# EasyEDA Pro project MAX2831_2024_REUSE.eprj

# Schematic MAX2831_2024_REUSE
Board Name: MAX2831_2024_REUSE; Create Date: 2024-12-31; Page Name: P1; Project Name: MAX2831_2024_REUSE; Schematic Name: MAX2831_2024_REUSE; Update Date: 2025-01-03; Company: EasyEDA.com; Page Size: A4; Version: V1.0
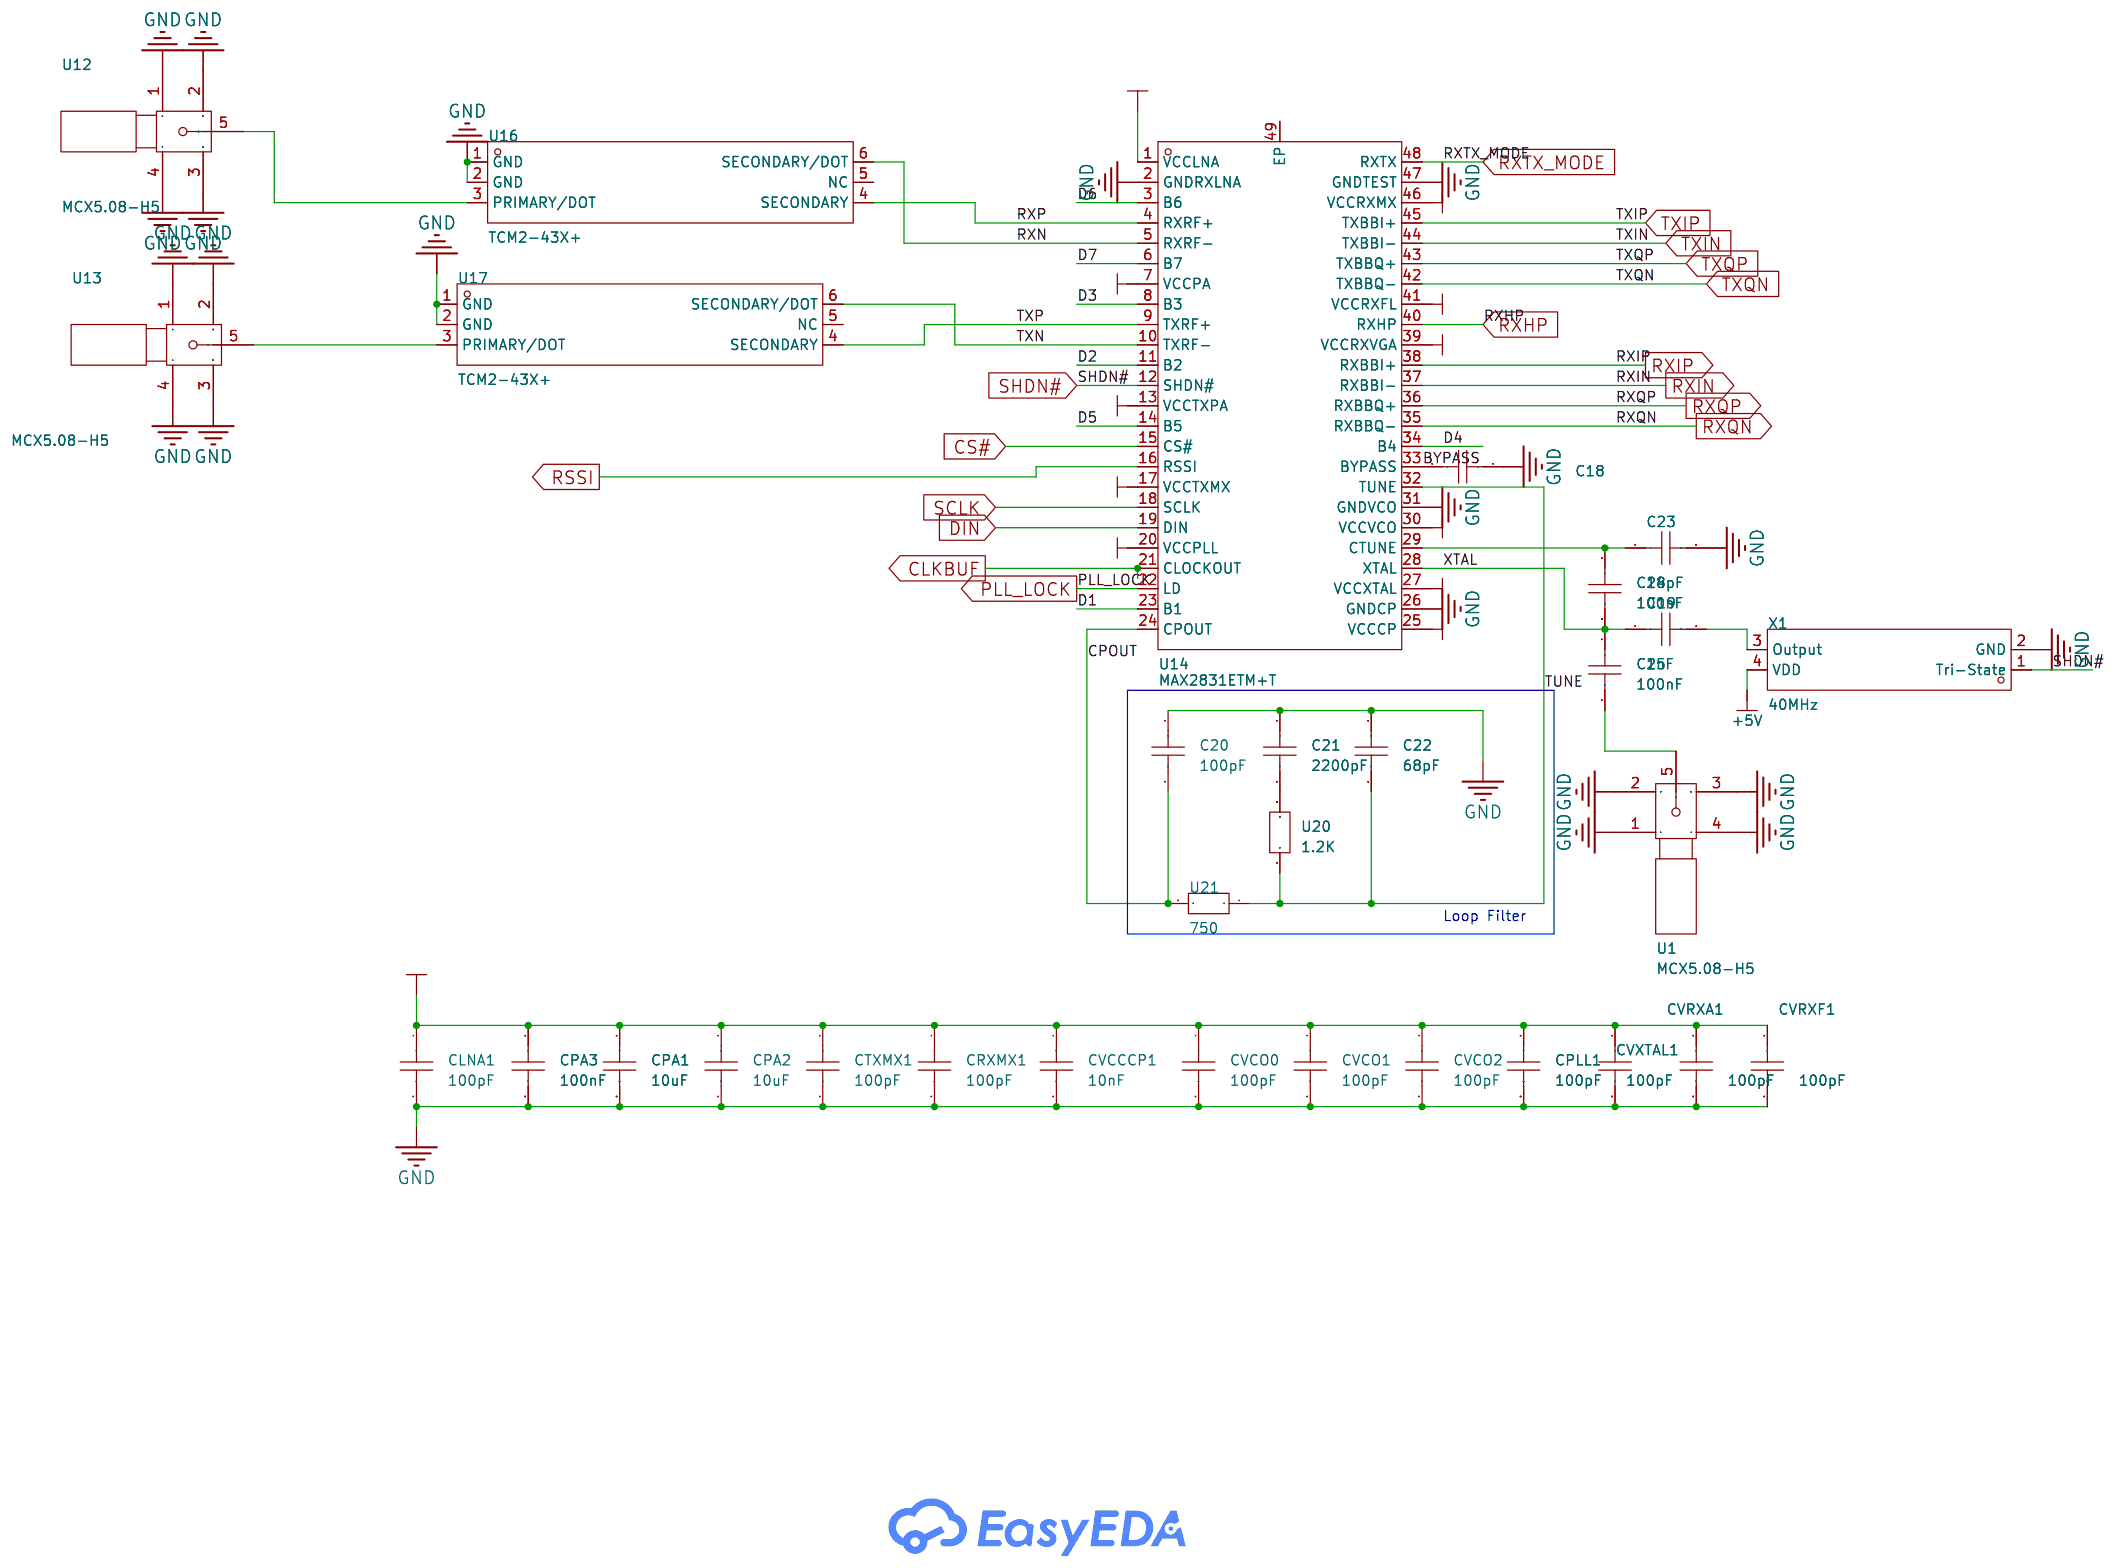
[diagram p0: schematic sheet]

## Parts
C18  100nF  [C0805]
C19  1nF  [C0805]
C20  100pF  [C0805]
C21  2200pF  [C0805]
C22  68pF  [C0805]
C23  18pF  [C0805]
C24  100nF  [C0805]
C25  100nF  [C0805]
CLNA1  100pF  [C0805]
CPA1  10uF  [C0805]
CPA2  10uF  [C0805]
CPA3  100nF  [C0805]
CPLL1  100pF  [C0805]
CRXMX1  100pF  [C0805]
CTXMX1  100pF  [C0805]
CVCCCP1  10nF  [C0805]
CVCO0  100pF  [C0805]
CVCO1  100pF  [C0805]
CVCO2  100pF  [C0805]
CVRXA1  100pF  [C0805]
CVRXF1  100pF  [C0805]
CVXTAL1  100pF  [C0805]
U1  MCX5.08-H5  [SMA-TH_MCX5.08-H5]
U12  MCX5.08-H5  [SMA-TH_MCX5.08-H5]
U13  MCX5.08-H5  [SMA-TH_MCX5.08-H5]
U14  MAX2831ETM+T  [TQFN-48_L7.0-W7.0-P0.50-TL-EP5.6]
U16  TCM2-43X+  [IND-SMD_6P-L4.1-W3.8-P1.27-TL]
U17  TCM2-43X+  [IND-SMD_6P-L4.1-W3.8-P1.27-TL]
U20  1.2K  [R0805]
U21  750  [R0805]
X1  40MHz  [OSC-SMD_4P-L3.2-W2.5-BL]

## Library data of the parts
C18-C23 CLNA1 CPA1-CPA3 CPLL1 CRXMX1 CTXMX1 CVCCCP1 CVCO0-CVCO2 CVRXA1 CVRXF1 CVXTAL1 = CAP_0603: Supplier Footprint: 0603
C24 C25 = CAP_0805: Supplier Footprint: 0805
U1 U12 U13 = MCX5.08-H5_C9900009324: Supplier Part: C9900009324; Supplier Footprint: COAX-F; JLCPCB Part Class: Extended Part; Supplier: LCSC
U14 = MAX2831ETM+T: Frequency Range:2.4GHz Frequency Range:2.4GHz Interface:SPI Operating Voltage:2.7V~3.6V Operating Voltage:2.7V~3.6V Applications:WiFi Output Power:21dBm Data Rate:54Mbps Current Of Transmitting:82mA Sensitivity:-76dBm Receive Current:62mA Operating Temper; Supplier Part: C2152047; Manufacturer: ADI(亚德诺)/MAXIM(美信); Supplier Footprint: TQFN-48-EP(7x7); JLCPCB Part Class: Extended Part; Datasheet: https://atta.szlcsc.com/upload/public/pdf/source/20210601/D5E13A4F591163B65DE03F91E5182685.pdf; Supplier: LCSC; Frequency Range: 2.4GHz; Interface: SPI; Operating Voltage: 2.7V~3.6V; Applications: WiFi; Output Power: 21dBm; Data Rate: 54Mbps; Current Of Transmitting: 82mA; Sensitivity: -76dBm; Receive Current: 62mA; Operating Temperature: -40℃~+85℃
U16 U17 = TCM2-43X+: Frequency Range:10MHz~4GHz Frequency Range:10MHz~4GHz Impedance Ratio-Unbalanced/Balanced:1:2 Insertion Loss (Max):3dB Phase Balance:7° Return Loss (Min):14.98dB; LCSC Part Name: 射频变压器; Supplier Part: C2885644; Manufacturer: Mini-Circuits; Supplier Footprint: SMD-6P; JLCPCB Part Class: Extended Part; Datasheet: https://atta.szlcsc.com/upload/public/pdf/source/20210825/C2885644_24D8D5254C12C7AF6CFE8387515C0B6D.pdf; Supplier: LCSC; Frequency Range: 10MHz~4GHz; Impedance Ratio-Unbalanced/Balanced: 1:2; Insertion Loss (Max): 3dB; Phase Balance: 7°; Return Loss (Min): 14.98dB
U20 U21 = SCR0805J1M: Type:Thick Film Resistors Resistance:1MΩ Tolerance:±5% Tolerance:±5% Power(Watts): Overload Voltage (Max): Operating Temperature Range:-55℃~+155℃ Operating Temperature Range:-55℃~+155℃; LCSC Part Name: 1MΩ ±5%; Supplier Part: C5140152; Manufacturer: VO(翔胜); Supplier Footprint: 0805; JLCPCB Part Class: Extended Part; Datasheet: https://atta.szlcsc.com/upload/public/pdf/source/20220823/E5DDB4243192CD3C8AE9677163F934FF.pdf; Supplier: LCSC; Type: Thick Film Resistors; Tolerance: ±5%; Operating Temperature Range: -55℃~+155℃
X1 = SX3M40.000E20F30THN: LCSC Part Name: 40MHz ±20ppm 1.2V CMOS; Supplier Part: C5137265; Manufacturer: SCTF(星通时频); Supplier Footprint: SMD3225-4P; JLCPCB Part Class: Extended Part; Datasheet: https://atta.szlcsc.com/upload/public/pdf/source/20240614/033A047EF017DF3AA642F42E2CA84B17.pdf; Supplier: LCSC; Normal temperature Frequency Tolerance: ±20ppm; Output Type: CMOS; Supply Voltage: 1.2V; Supply Current (Max): 2mA; Frequency Stability: ±30ppm; Operating Temperature: -40℃~+85℃

## Nets
+5V: X1.4(VDD)
GND: C18.1 C20.1 C21.1 C22.1 C23.2 CLNA1.2 CPA1.2 CPA2.2 CPA3.2 CPLL1.2 CRXMX1.2 CTXMX1.2 CVCCCP1.2 CVCO0.2 CVCO1.2 CVCO2.2 CVRXA1.2 CVRXF1.2 CVXTAL1.2 U1.1 U1.2 U1.3 U1.4 U12.1 U12.2 U12.3 U12.4 U13.1 U13.2 U13.3 U13.4 U14.2(GNDRXLNA) U14.26(GNDCP) U14.31(GNDVCO) U14.47(GNDTEST) U16.1(GND) U16.2(GND) U17.1(GND) U17.2(GND) X1.2(GND)
3.3: CLNA1.1 CPA1.1 CPA2.1 CPA3.1 CPLL1.1 CRXMX1.1 CTXMX1.1 CVCCCP1.1 CVCO0.1 CVCO1.1 CVCO2.1 CVRXA1.1 CVRXF1.1 CVXTAL1.1 U14.1(VCCLNA) U14.7(VCCPA) U14.13(VCCTXPA) U14.17(VCCTXMX) U14.20(VCCPLL) U14.25(VCCCP) U14.27(VCCXTAL) U14.30(VCCVCO) U14.39(VCCRXVGA) U14.41(VCCRXFL) U14.46(VCCRXMX)
BYPASS: C18.2 U14.33(BYPASS)
CLKBUF: U14.21(CLOCKOUT)
CPOUT: C20.2 U14.24(CPOUT) U21.2
CS#: U14.15(CS#)
D1: U14.23(B1)
D2: U14.11(B2)
D3: U14.8(B3)
D4: U14.34(B4)
D5: U14.14(B5)
D6: U14.3(B6)
D7: U14.6(B7)
DIN: U14.19(DIN)
PLL_LOCK: U14.22(LD)
RSSI: U14.16(RSSI)
RXHP: U14.40(RXHP)
RXIN: U14.37(RXBBI-)
RXIP: U14.38(RXBBI+)
RXN: U14.5(RXRF-) U16.6(SECONDARY/DOT)
RXP: U14.4(RXRF+) U16.4(SECONDARY)
RXQN: U14.35(RXBBQ-)
RXQP: U14.36(RXBBQ+)
RXTX_MODE: U14.48(RXTX)
SCLK: U14.18(SCLK)
SHDN#: U14.12(SHDN#) X1.1(Tri-State)
TUNE: C22.2 U14.32(TUNE) U20.1 U21.1
TXIN: U14.44(TXBBI-)
TXIP: U14.45(TXBBI+)
TXN: U14.10(TXRF-) U17.6(SECONDARY/DOT)
TXP: U14.9(TXRF+) U17.4(SECONDARY)
TXQN: U14.42(TXBBQ-)
TXQP: U14.43(TXBBQ+)
XTAL: C19.2 C24.2 C25.1 U14.28(XTAL)
$1N1513: U12.5 U16.3(PRIMARY/DOT)
$1N1514: U13.5 U17.3(PRIMARY/DOT)
$1N1515: C21.2 U20.2
$1N2254: C23.1 C24.1 U14.29(CTUNE)
$1N2490: C19.1 X1.3(Output)
$1N3884: C25.2 U1.5

Not connected (* = marked no-connect by the designer): U14 49(EP); U16 5(NC); U17 5(NC)

## Notes on the sheet
- Loop Filter

# Board MAX2831_2024_REUSE
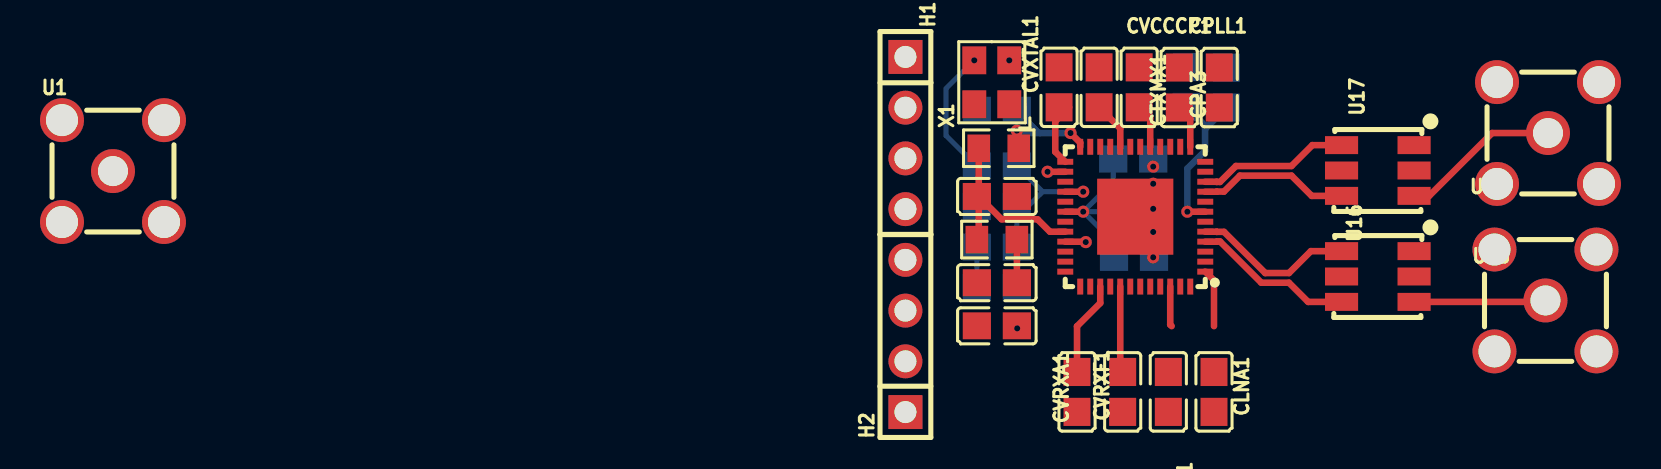
[diagram p1: board, top side]
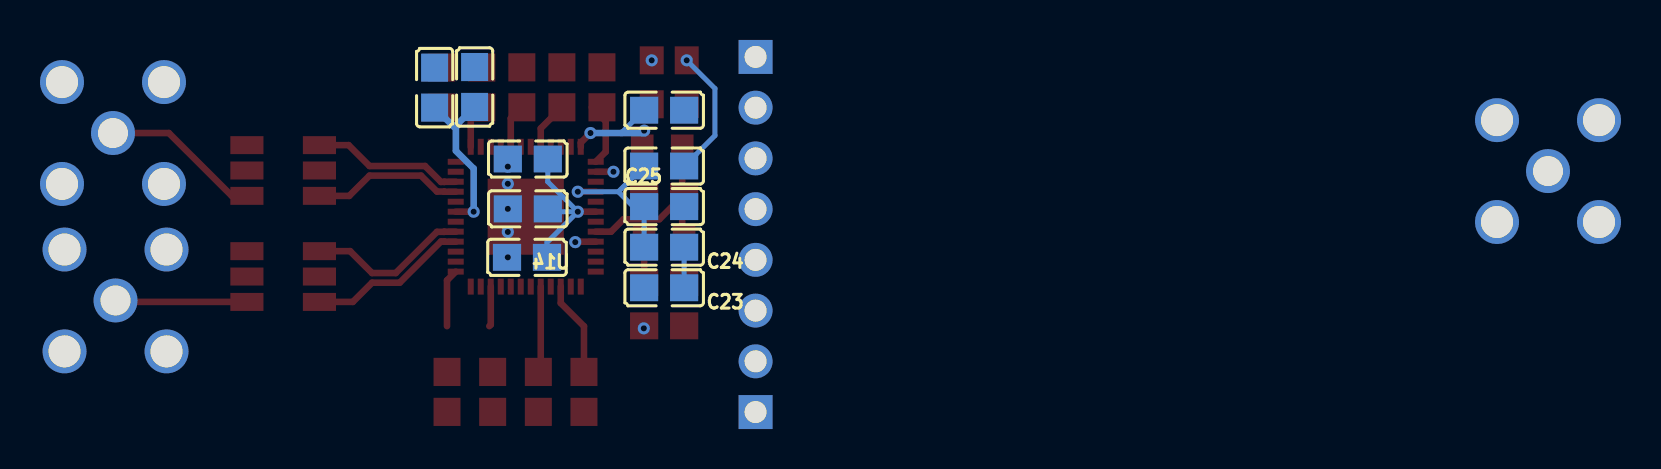
[diagram p2: board, bottom side, seen from below]

No outline. copper layers: Top Layer, Bottom Layer. Coordinates in mm from the lowest, leftmost part position.
Stack: Top Layer 0.035mm / Dielectric1 1.51mm FR4 er 4.5 / Bottom Layer 0.035mm

## Design rules (mm)
net TXP: TX
net TXN: TX
net RXN: RX
net RXP: RX
net RXQN: RXQ
net RXQP: RXQ
net RXIN: RXI
net RXIP: RXI
net TXQN: TXQ
net TXQP: TXQ
net TXIN: TXI
net TXIP: TXI
template: JLCPCB Capability(Two Layers Board)
spacing copperThickness1oz (default): track to track 0.102, other pairs 0.152 to 0.3
spacing copperThickness2oz: track to track 0.203, other pairs 0.152 to 0.3
track width copperThickness1oz (default): min 0.127, default 0.254, max 2.54
track width copperThickness2oz: min 0.203, default 0.254, max 2.54
differential pair differentialPair (default): width min 0.127, default 0.254, max 2.54; gap min 0.152, default 0.152
via viaSize (default): diameter min 0.5, default 0.61, max 10; hole min 0.3, default 0.305, max 6.3

## Placement (name value [footprint] x y rotation side)
C18  100nF  [C0805]  44.2 3.31 0 top
C19  1nF  [C0805]  44.2 11.31 0 bottom
C20  100pF  [C0805]  44.2 14.1 0 bottom
C21  2200pF  [C0805]  44.2 5.47 0 top
C22  68pF  [C0805]  44.2 9.79 180 top
C23  18pF  [C0805]  44.2 5.21 0 bottom
C24  100nF  [C0805]  44.2 7.25 0 bottom
C25  100nF  [C0805]  44.2 9.28 180 bottom
CLNA1  100pF  [C0805]  55.05 0 270 top
CPA1  10uF  [C0805]  53.67 15.27 90 bottom
CPA2  10uF  [C0805]  55.67 15.23 90 bottom
CPA3  100nF  [C0805]  55.32 15.24 90 top
CPLL1  100pF  [C0805]  51.31 15.25 90 top
CRXMX1  100pF  [C0805]  52.77 0 270 top
CTXMX1  100pF  [C0805]  53.31 15.24 90 top
CVCCCP1  10nF  [C0805]  49.31 15.25 90 top
CVCO0  100pF  [C0805]  51.01 11.66 0 bottom
CVCO1  100pF  [C0805]  51.01 9.16 0 bottom
CVCO2  100pF  [C0805]  51.05 6.74 0 bottom
CVRXA1  100pF  [C0805]  48.2 0 270 top
CVRXF1  100pF  [C0805]  50.49 0 270 top
CVXTAL1  100pF  [C0805]  47.31 15.25 90 top
H1  -  [HDR-TH_4P-P2.54-V-M]  39.62 12.96 270 top
H2  -  [HDR-TH_4P-P2.54-V-M]  39.62 2.8 90 top
U1  MCX5.08-H5  [SMA-TH_MCX5.08-H5]  0 11.06 0 top
U12  MCX5.08-H5  [SMA-TH_MCX5.08-H5]  71.63 4.58 0 top
U13  MCX5.08-H5  [SMA-TH_MCX5.08-H5]  71.75 12.96 0 top
U14  MAX2831ETM+T  [TQFN-48_L7.0-W7.0-P0.50-TL-EP5.6]  51.12 8.77 180 top
U16  TCM2-43X+  [IND-SMD_6P-L4.1-W3.8-P1.27-TL]  63.25 5.78 270 top
U17  TCM2-43X+  [IND-SMD_6P-L4.1-W3.8-P1.27-TL]  63.25 11.08 270 top
U20  1.2K  [R0805]  44.2 7.63 0 top
U21  750  [R0805]  44.29 12.2 0 top
X1  40MHz  [OSC-SMD_4P-L3.2-W2.5-BL]  43.94 15.5 90 top

## Footprints (pads in the part's own frame, mm; a bottom-side part is the same pattern mirrored in y, then rotated)
C0805
  rect 1.41x1.35 smd: 1(-1,0) 2(1,0)
HDR-TH_4P-P2.54-V-M
  rect 1.7x1.7 hole 1.1: 1(-3.81,0)
  round 1.7 hole 1.1: 2(-1.27,0) 3(1.27,0) 4(3.81,0)
IND-SMD_6P-L4.1-W3.8-P1.27-TL
  rect 0.9x1.657 smd: 1(-1.27,1.813) 2(0,1.813) 3(1.27,1.813) 4(1.27,-1.813) 5(0,-1.813) 6(-1.27,-1.813)
OSC-SMD_4P-L3.2-W2.5-BL
  rect 1.4x1.2 smd: 1(-1.1,-0.875) 2(1.1,-0.875) 3(1.1,0.875) 4(-1.1,0.875)
R0805
  rect 1.133x1.377 smd: 1(-1,0) 2(1,0)
SMA-TH_MCX5.08-H5
  round 2.2 hole 1.6: 1(-2.55,-2.55) 2(-2.55,2.55) 3(2.55,2.55) 4(2.55,-2.55)
  round 2.2 hole 1.5: 5(0,0)
TQFN-48_L7.0-W7.0-P0.50-TL-EP5.6
  rect 0.8x0.3 smd: 1(-3.5,2.751) 2(-3.5,2.251) 3(-3.5,1.75) 4(-3.5,1.251) 5(-3.5,0.75) 6(-3.5,0.252) 7(-3.5,-0.249) 8(-3.5,-0.75) 9(-3.5,-1.25) 10(-3.5,-1.75) 11(-3.5,-2.249) 12(-3.5,-2.748) 25(3.5,-2.748) 26(3.5,-2.249) 27(3.5,-1.75) 28(3.5,-1.25) 29(3.5,-0.75) 30(3.5,-0.249) 31(3.5,0.252) 32(3.5,0.75) 33(3.5,1.251) 34(3.5,1.75) 35(3.5,2.251) 36(3.5,2.751)
  rect 0.3x0.8 smd: 13(-2.751,-3.5) 14(-2.251,-3.5) 15(-1.75,-3.5) 16(-1.25,-3.5) 17(-0.75,-3.5) 18(-0.251,-3.5) 19(0.249,-3.5) 20(0.75,-3.5) 21(1.25,-3.5) 22(1.75,-3.5) 23(2.251,-3.5) 24(2.751,-3.5) 37(2.751,3.5) 38(2.251,3.5) 39(1.75,3.5) 40(1.25,3.5) 41(0.75,3.5) 42(0.251,3.5) 43(-0.251,3.5) 44(-0.75,3.5) 45(-1.25,3.5) 46(-1.75,3.5) 47(-2.251,3.5) 48(-2.751,3.5)
  rect 3.81x3.81 smd: 49(0,0.001)

## Nets
+5V: X1.4
GND: C18.1 C20.1 C21.1 C22.1 C23.2 CLNA1.2 CPA1.2 CPA2.2 CPA3.2 CPLL1.2 CRXMX1.2 CTXMX1.2 CVCCCP1.2 CVCO0.2 CVCO1.2 CVCO2.2 CVRXA1.2 CVRXF1.2 CVXTAL1.2 U1.1 U1.2 U1.3 U1.4 U12.1 U12.2 U12.3 U12.4 U13.1 U13.2 U13.3 U13.4 U14.2 U14.26 U14.31 U14.47 U14.49 U16.1 U16.2 U17.1 U17.2 X1.2
3.3: CLNA1.1 CPA1.1 CPA2.1 CPA3.1 CPLL1.1 CRXMX1.1 CTXMX1.1 CVCCCP1.1 CVCO0.1 CVCO1.1 CVCO2.1 CVRXA1.1 CVRXF1.1 CVXTAL1.1 U14.1 U14.7 U14.13 U14.17 U14.20 U14.25 U14.27 U14.30 U14.39 U14.41 U14.46
BYPASS: C18.2 U14.33
CLKBUF: U14.21
CPOUT: C20.2 U14.24 U21.2
CS#: U14.15
D1: U14.23
D2: U14.11
D3: U14.8
D4: U14.34
D5: U14.14
D6: U14.3
D7: U14.6
DIN: U14.19
PLL_LOCK: U14.22
RSSI: U14.16
RXHP: U14.40
RXIN: H2.2 U14.37
RXIP: H2.1 U14.38
RXN: U14.5 U16.6
RXP: U14.4 U16.4
RXQN: H2.4 U14.35
RXQP: H2.3 U14.36
RXTX_MODE: U14.48
SCLK: U14.18
SHDN#: U14.12 X1.1
TUNE: C22.2 U14.32 U20.1 U21.1
TXIN: H1.2 U14.44
TXIP: H1.1 U14.45
TXN: U14.10 U17.6
TXP: U14.9 U17.4
TXQN: H1.4 U14.42
TXQP: H1.3 U14.43
XTAL: C19.2 C24.2 C25.1 U14.28
$1N1513: U12.5 U16.3
$1N1514: U13.5 U17.3
$1N1515: C21.2 U20.2
$1N2254: C23.1 C24.1 U14.29
$1N2490: C19.1 X1.3
$1N3884: C25.2 U1.5

Pads without a net: U16 5; U17 5

## Via types
v1: diameter 0.61, hole 0.305, Top Layer to Bottom Layer, 15 vias

## Routing (per net, layer and track width the routed paths; a pad name or vN(x,y) marks a point on that pad's centre or on a via; arc(x,y) is an arc through that point)
GND: length 0.9
  Top Layer w0.33: 47.62,11.02 46.73,11.02
  vias: v1(44.82,16.6) v1(46.73,11.02) v1(52.01,11.28) v1(52.01,10.42) v1(52.01,9.16) v1(52.01,8.01) v1(52.01,6.74)
3.3: length 41.1
  Top Layer w0.33: U14.30 v1(48.51,9.02) ; 50.57,1.01 50.37,1.21 U14.41 ; U14.25 47.12,12.02 47.12,13.55 47.81,14.25 ; U14.20 50.37,13.19 CVCCCP1.1 ; 55.05,3.3 55.05,5.58 54.62,6.02 ; U14.46 52.87,3.37 52.94,3.3 ; U14.7 v1(53.72,9.02) ; U14.39 49.37,4.45 48.2,3.29 CVRXA1.1 ; CPLL1.1 51.87,13.69 U14.17 ; CTXMX1.1 53.87,13.69 U14.13
  Bottom Layer w0.254: CVCO2.1 50.05,7.48 v1(48.51,9.02) ; CVCO0.1 50.01,10.52 v1(48.51,9.02) ; v1(48.51,9.02) 49.87,9.02 CVCO1.1
  Bottom Layer w0.33: 54.61,13.17 54.61,12.07 53.72,11.18 v1(53.72,9.02) ; 54.61,13.17 CPA2.1 ; 54.61,13.17 54.61,13.33 CPA1.1
BYPASS: length 1.2
  Top Layer w0.33: U14.33 48.62,7.52 v1(48.64,7.5) ; v1(45.21,3.18) 45.2,3.2 C18.2
CPOUT: length 6.2
  Top Layer w0.33: U14.24 48.37,12.47 v1(47.88,12.96) ; U21.2 45.2,12.29 v1(45.2,13.08)
  Bottom Layer w0.254: 46.34,12.96 C20.2
  Bottom Layer w0.33: v1(47.88,12.96) 45.31,12.96 v1(45.2,13.08)
RXN: length 8.1
  Top Layer w0.33: U16.6 59.9,7.05 58.8,5.95 57.62,5.95 55.56,8.01 55.19,8.01 55.18,8.02 U14.5
RXP: length 8.1
  Top Layer w0.33: U14.4 55.18,7.52 55.19,7.53 55.35,7.53 57.42,5.47 58.8,5.47 59.76,4.51 U16.4
TUNE: length 9.7
  Top Layer w0.33: 43.29,9.79 44.43,8.64 46.23,8.64 46.85,8.02 U14.32 ; 43.29,9.79 43.29,7.72 U20.1 ; 43.29,9.79 U21.1
TXN: length 7.6
  Top Layer w0.33: U14.10 55.18,10.52 55.19,10.51 55.35,10.51 56.15,11.31 58.93,11.31 59.97,12.35 U17.6
TXP: length 7.6
  Top Layer w0.33: U17.4 59.94,9.81 58.93,10.83 56.35,10.83 55.56,10.03 55.19,10.03 55.18,10.02 U14.9
XTAL: length 8.1
  Top Layer w0.33: v1(48.51,10.02) U14.28
  Bottom Layer w0.254: 46.48,10.02 45.2,8.73 C24.2 ; 46.48,10.02 C19.2 ; 46.48,10.02 v1(48.51,10.02)
$1N1513: length 6.6
  Top Layer w0.33: U12.5 71.56,4.51 U16.3
$1N1514: length 8
  Top Layer w0.33: U13.5 68.96,12.96 65.81,9.81 U17.3
$1N1515: length 2.2
  Top Layer w0.33: U20.2 C21.2
$1N2254: length 2
  Bottom Layer w0.254: C24.1 C23.1
$1N2490: length 6.5
  Bottom Layer w0.254: C19.1 43.18,11.31 41.66,12.83 41.66,15.19 v1(43.07,16.6)
